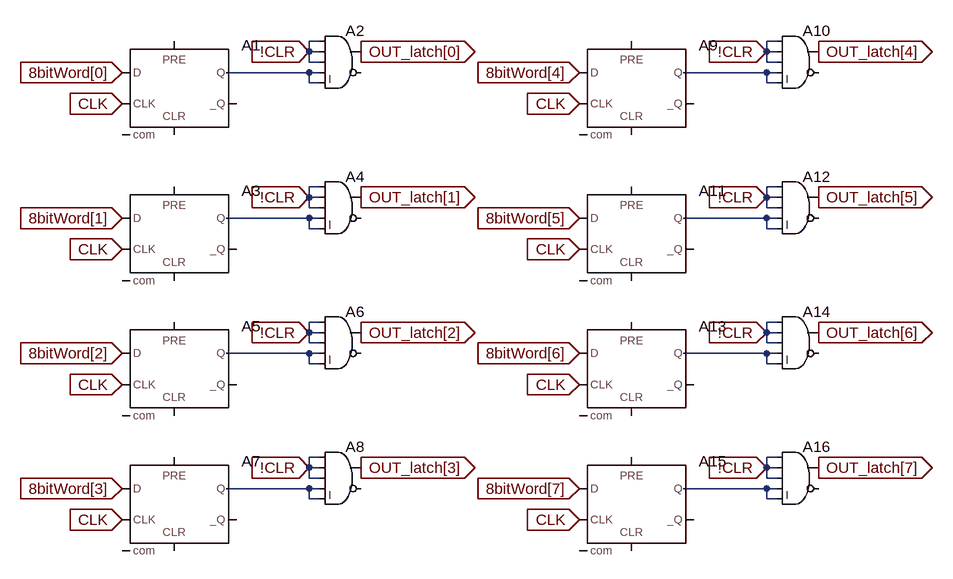
[diagram p0: schematic Latch_8bit.asc]
Latch_8bit.asc, the LTspice schematic file:
Version 4
SHEET 1 1284 920
WIRE 272 80 256 80
WIRE 976 80 960 80
WIRE 256 96 256 80
WIRE 272 96 256 96
WIRE 960 96 960 80
WIRE 976 96 960 96
WIRE 256 112 256 96
WIRE 272 112 256 112
WIRE 960 112 960 96
WIRE 976 112 960 112
WIRE 256 128 128 128
WIRE 272 128 256 128
WIRE 960 128 832 128
WIRE 976 128 960 128
WIRE 256 144 256 128
WIRE 272 144 256 144
WIRE 960 144 960 128
WIRE 976 144 960 144
WIRE 272 304 256 304
WIRE 976 304 960 304
WIRE 256 320 256 304
WIRE 272 320 256 320
WIRE 960 320 960 304
WIRE 976 320 960 320
WIRE 256 336 256 320
WIRE 272 336 256 336
WIRE 960 336 960 320
WIRE 976 336 960 336
WIRE 256 352 128 352
WIRE 272 352 256 352
WIRE 960 352 832 352
WIRE 976 352 960 352
WIRE 256 368 256 352
WIRE 272 368 256 368
WIRE 960 368 960 352
WIRE 976 368 960 368
WIRE 272 512 256 512
WIRE 976 512 960 512
WIRE 256 528 256 512
WIRE 272 528 256 528
WIRE 960 528 960 512
WIRE 976 528 960 528
WIRE 256 544 256 528
WIRE 272 544 256 544
WIRE 960 544 960 528
WIRE 976 544 960 544
WIRE 256 560 128 560
WIRE 272 560 256 560
WIRE 960 560 832 560
WIRE 976 560 960 560
WIRE 256 576 256 560
WIRE 272 576 256 576
WIRE 960 576 960 560
WIRE 976 576 960 576
WIRE 272 720 256 720
WIRE 976 720 960 720
WIRE 256 736 256 720
WIRE 272 736 256 736
WIRE 960 736 960 720
WIRE 976 736 960 736
WIRE 256 752 256 736
WIRE 272 752 256 752
WIRE 960 752 960 736
WIRE 976 752 960 752
WIRE 256 768 128 768
WIRE 272 768 256 768
WIRE 960 768 832 768
WIRE 976 768 960 768
WIRE 256 784 256 768
WIRE 272 784 256 784
WIRE 960 784 960 768
WIRE 976 784 960 784
FLAG 256 96 !CLR
IOPIN 256 96 In
FLAG 336 96 OUT_latch[0]
IOPIN 336 96 Out
FLAG -32 176 CLK
IOPIN -32 176 In
FLAG -32 128 8bitWord[0]
IOPIN -32 128 In
FLAG 256 320 !CLR
IOPIN 256 320 In
FLAG 336 320 OUT_latch[1]
IOPIN 336 320 Out
FLAG -32 400 CLK
IOPIN -32 400 In
FLAG -32 352 8bitWord[1]
IOPIN -32 352 In
FLAG 256 528 !CLR
IOPIN 256 528 In
FLAG 336 528 OUT_latch[2]
IOPIN 336 528 Out
FLAG -32 608 CLK
IOPIN -32 608 In
FLAG -32 560 8bitWord[2]
IOPIN -32 560 In
FLAG 256 736 !CLR
IOPIN 256 736 In
FLAG 336 736 OUT_latch[3]
IOPIN 336 736 Out
FLAG -32 816 CLK
IOPIN -32 816 In
FLAG -32 768 8bitWord[3]
IOPIN -32 768 In
FLAG 960 96 !CLR
IOPIN 960 96 In
FLAG 1040 96 OUT_latch[4]
IOPIN 1040 96 Out
FLAG 672 176 CLK
IOPIN 672 176 In
FLAG 672 128 8bitWord[4]
IOPIN 672 128 In
FLAG 960 320 !CLR
IOPIN 960 320 In
FLAG 1040 320 OUT_latch[5]
IOPIN 1040 320 Out
FLAG 672 400 CLK
IOPIN 672 400 In
FLAG 672 352 8bitWord[5]
IOPIN 672 352 In
FLAG 960 528 !CLR
IOPIN 960 528 In
FLAG 1040 528 OUT_latch[6]
IOPIN 1040 528 Out
FLAG 672 608 CLK
IOPIN 672 608 In
FLAG 672 560 8bitWord[6]
IOPIN 672 560 In
FLAG 960 736 !CLR
IOPIN 960 736 In
FLAG 1040 736 OUT_latch[7]
IOPIN 1040 736 Out
FLAG 672 816 CLK
IOPIN 672 816 In
FLAG 672 768 8bitWord[7]
IOPIN 672 768 In
SYMBOL Digital\\dflop 48 80 R0
SYMATTR InstName A1
SYMATTR SpiceLine td=11n
SYMBOL Digital\\and 304 48 R0
SYMATTR InstName A2
SYMBOL Digital\\and 304 272 R0
SYMATTR InstName A4
SYMBOL Digital\\and 304 480 R0
SYMATTR InstName A6
SYMBOL Digital\\and 304 688 R0
SYMATTR InstName A8
SYMBOL Digital\\and 1008 48 R0
SYMATTR InstName A10
SYMBOL Digital\\and 1008 272 R0
SYMATTR InstName A12
SYMBOL Digital\\and 1008 480 R0
SYMATTR InstName A14
SYMBOL Digital\\and 1008 688 R0
SYMATTR InstName A16
SYMBOL Digital\\dflop 48 304 R0
SYMATTR InstName A3
SYMATTR SpiceLine td=11n
SYMBOL Digital\\dflop 48 512 R0
SYMATTR InstName A5
SYMATTR SpiceLine td=11n
SYMBOL Digital\\dflop 48 720 R0
SYMATTR InstName A7
SYMATTR SpiceLine td=11n
SYMBOL Digital\\dflop 752 80 R0
SYMATTR InstName A9
SYMATTR SpiceLine td=11n
SYMBOL Digital\\dflop 752 304 R0
SYMATTR InstName A11
SYMATTR SpiceLine td=11n
SYMBOL Digital\\dflop 752 512 R0
SYMATTR InstName A13
SYMATTR SpiceLine td=11n
SYMBOL Digital\\dflop 752 720 R0
SYMATTR InstName A15
SYMATTR SpiceLine td=11n

The netlist it stands for:
* Latch_8bit.asc
A1 8bitWord[0] 0 CLK 0 0 0 N001 0 DFLOP td=11n
A2 !CLR !CLR !CLR N001 N001 0 OUT_latch[0] 0 AND
A4 !CLR !CLR !CLR N003 N003 0 OUT_latch[1] 0 AND
A6 !CLR !CLR !CLR N005 N005 0 OUT_latch[2] 0 AND
A8 !CLR !CLR !CLR N007 N007 0 OUT_latch[3] 0 AND
A10 !CLR !CLR !CLR N002 N002 0 OUT_latch[4] 0 AND
A12 !CLR !CLR !CLR N004 N004 0 OUT_latch[5] 0 AND
A14 !CLR !CLR !CLR N006 N006 0 OUT_latch[6] 0 AND
A16 !CLR !CLR !CLR N008 N008 0 OUT_latch[7] 0 AND
A3 8bitWord[1] 0 CLK 0 0 0 N003 0 DFLOP td=11n
A5 8bitWord[2] 0 CLK 0 0 0 N005 0 DFLOP td=11n
A7 8bitWord[3] 0 CLK 0 0 0 N007 0 DFLOP td=11n
A9 8bitWord[4] 0 CLK 0 0 0 N002 0 DFLOP td=11n
A11 8bitWord[5] 0 CLK 0 0 0 N004 0 DFLOP td=11n
A13 8bitWord[6] 0 CLK 0 0 0 N006 0 DFLOP td=11n
A15 8bitWord[7] 0 CLK 0 0 0 N008 0 DFLOP td=11n
.backanno
.end